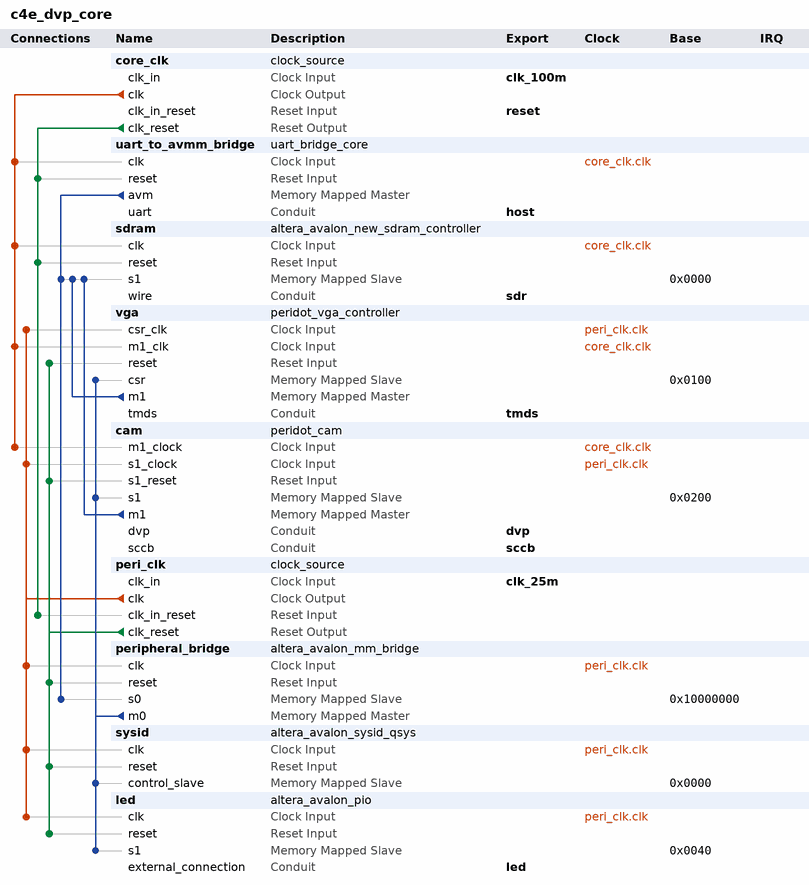
[diagram p0: system contents]
# Platform Designer (Qsys) system c4e_dvp_core, Cyclone IV E EP4CE6E22C8
# Parameters at their usual value, and those the tool derives, are not listed.
package require -exact qsys 20.1
create_system c4e_dvp_core
set_project_property DEVICE_FAMILY {Cyclone IV E}
set_project_property DEVICE EP4CE6E22C8

add_instance core_clk clock_source 20.1
set_instance_parameter_value core_clk clockFrequency 100000000

add_instance uart_to_avmm_bridge uart_bridge_core 1.0

add_instance sdram altera_avalon_new_sdram_controller 20.1
set_instance_parameter_value sdram TAC 6.0
set_instance_parameter_value sdram TRCD 21.0
set_instance_parameter_value sdram TRFC 63.0
set_instance_parameter_value sdram TRP 21.0
set_instance_parameter_value sdram casLatency 2
set_instance_parameter_value sdram columnWidth 9
set_instance_parameter_value sdram dataWidth 16
set_instance_parameter_value sdram generateSimulationModel false
set_instance_parameter_value sdram model single_Micron_MT48LC4M32B2_7_chip
set_instance_parameter_value sdram numberOfBanks 4
set_instance_parameter_value sdram numberOfChipSelects 1
set_instance_parameter_value sdram powerUpDelay 200.0
set_instance_parameter_value sdram refreshPeriod 7.8125
set_instance_parameter_value sdram rowWidth 13

add_instance vga peridot_vga_controller 20.0.99
set_instance_parameter_value vga AVM_CLOCKFREQ 100000000
set_instance_parameter_value vga BURSTCOUNT_WIDTH 8
set_instance_parameter_value vga CSR_CLOCKFREQ 25000000
set_instance_parameter_value vga DOTCLOCK_FREQUENCY 65.0
set_instance_parameter_value vga INTERFACE_MODE DVI
set_instance_parameter_value vga LINEOFFSETBYTES 2560
set_instance_parameter_value vga PART_NAME EP4CE6E22C8
set_instance_parameter_value vga PCMSAMPLE_FREQUENCY 44100
set_instance_parameter_value vga PIXEL_COLORORDER YUV422
set_instance_parameter_value vga PIXEL_DATAORDER BYTE
set_instance_parameter_value vga PIXEL_QUEUE 2
set_instance_parameter_value vga SUPPORT_AUDIOSTREAM 0
set_instance_parameter_value vga SUPPORT_RESOLUTION 3
set_instance_parameter_value vga VIDEO_HACTIVE 480
set_instance_parameter_value vga VIDEO_HBACKP 0
set_instance_parameter_value vga VIDEO_HSYNC 40
set_instance_parameter_value vga VIDEO_HTOTAL 525
set_instance_parameter_value vga VIDEO_VACTIVE 272
set_instance_parameter_value vga VIDEO_VBACKP 0
set_instance_parameter_value vga VIDEO_VSYNC 3
set_instance_parameter_value vga VIDEO_VTOTAL 288

add_instance cam peridot_cam 20.1
set_instance_parameter_value cam AVM_CLOCKFREQ 100000000
set_instance_parameter_value cam AVS_CLOCKFREQ 25000000
set_instance_parameter_value cam BURSTCOUNT_WIDTH 8
set_instance_parameter_value cam DVP_BYTESWAP OFF
set_instance_parameter_value cam DVP_FIFO_DEPTH 12
set_instance_parameter_value cam HW_TCL_DEBUG true
set_instance_parameter_value cam SCCB_CLOCKFREQ 400000
set_instance_parameter_value cam TRANSCYCLE_WIDTH 22
set_instance_parameter_value cam USE_PERIDOT_I2C OFF
set_instance_parameter_value cam USE_SCCB true

add_instance peri_clk clock_source 20.1
set_instance_parameter_value peri_clk clockFrequency 25000000

add_instance peripheral_bridge altera_avalon_mm_bridge 20.1
set_instance_parameter_value peripheral_bridge ADDRESS_UNITS SYMBOLS
set_instance_parameter_value peripheral_bridge ADDRESS_WIDTH 10
set_instance_parameter_value peripheral_bridge DATA_WIDTH 32
set_instance_parameter_value peripheral_bridge MAX_PENDING_RESPONSES 1
set_instance_parameter_value peripheral_bridge USE_AUTO_ADDRESS_WIDTH 1

add_instance sysid altera_avalon_sysid_qsys 20.1
set_instance_parameter_value sysid id -1608318703

add_instance led altera_avalon_pio 20.1
set_instance_parameter_value led direction Output
set_instance_parameter_value led width 4

# connections
add_connection core_clk.clk cam.m1_clock clock
add_connection core_clk.clk sdram.clk clock
add_connection core_clk.clk uart_to_avmm_bridge.clk clock
add_connection core_clk.clk vga.m1_clk clock
add_connection peri_clk.clk cam.s1_clock clock
add_connection peri_clk.clk led.clk clock
add_connection peri_clk.clk peripheral_bridge.clk clock
add_connection peri_clk.clk sysid.clk clock
add_connection peri_clk.clk vga.csr_clk clock
add_connection core_clk.clk_reset peri_clk.clk_in_reset reset
add_connection core_clk.clk_reset sdram.reset reset
add_connection core_clk.clk_reset uart_to_avmm_bridge.reset reset
add_connection peri_clk.clk_reset cam.s1_reset reset
add_connection peri_clk.clk_reset led.reset reset
add_connection peri_clk.clk_reset peripheral_bridge.reset reset
add_connection peri_clk.clk_reset sysid.reset reset
add_connection peri_clk.clk_reset vga.reset reset
add_connection cam.m1 sdram.s1 avalon
set_connection_parameter_value cam.m1/sdram.s1 baseAddress 0x0000
add_connection peripheral_bridge.m0 cam.s1 avalon
set_connection_parameter_value peripheral_bridge.m0/cam.s1 baseAddress 0x0200
add_connection peripheral_bridge.m0 led.s1 avalon
set_connection_parameter_value peripheral_bridge.m0/led.s1 baseAddress 0x0040
add_connection peripheral_bridge.m0 sysid.control_slave avalon
set_connection_parameter_value peripheral_bridge.m0/sysid.control_slave baseAddress 0x0000
add_connection peripheral_bridge.m0 vga.csr avalon
set_connection_parameter_value peripheral_bridge.m0/vga.csr baseAddress 0x0100
add_connection uart_to_avmm_bridge.avm peripheral_bridge.s0 avalon
set_connection_parameter_value uart_to_avmm_bridge.avm/peripheral_bridge.s0 baseAddress 0x10000000
add_connection uart_to_avmm_bridge.avm sdram.s1 avalon
set_connection_parameter_value uart_to_avmm_bridge.avm/sdram.s1 baseAddress 0x0000
add_connection vga.m1 sdram.s1 avalon
set_connection_parameter_value vga.m1/sdram.s1 baseAddress 0x0000

# exported interfaces
add_interface clk_100m clock sink
set_interface_property clk_100m EXPORT_OF core_clk.clk_in
add_interface clk_25m clock sink
set_interface_property clk_25m EXPORT_OF peri_clk.clk_in
add_interface dvp conduit end
set_interface_property dvp EXPORT_OF cam.dvp
add_interface host conduit end
set_interface_property host EXPORT_OF uart_to_avmm_bridge.uart
add_interface led conduit end
set_interface_property led EXPORT_OF led.external_connection
add_interface reset reset sink
set_interface_property reset EXPORT_OF core_clk.clk_in_reset
add_interface sccb conduit end
set_interface_property sccb EXPORT_OF cam.sccb
add_interface sdr conduit end
set_interface_property sdr EXPORT_OF sdram.wire
add_interface tmds conduit end
set_interface_property tmds EXPORT_OF vga.tmds

set_interconnect_requirement {$system} qsys_mm.clockCrossingAdapter HANDSHAKE
set_interconnect_requirement {$system} qsys_mm.enableEccProtection FALSE
set_interconnect_requirement {$system} qsys_mm.insertDefaultSlave FALSE
set_interconnect_requirement {$system} qsys_mm.maxAdditionalLatency 1

save_system c4e_dvp_core.qsys
